# Altium schematic sheet Current Regulator.SchDoc
size Letter
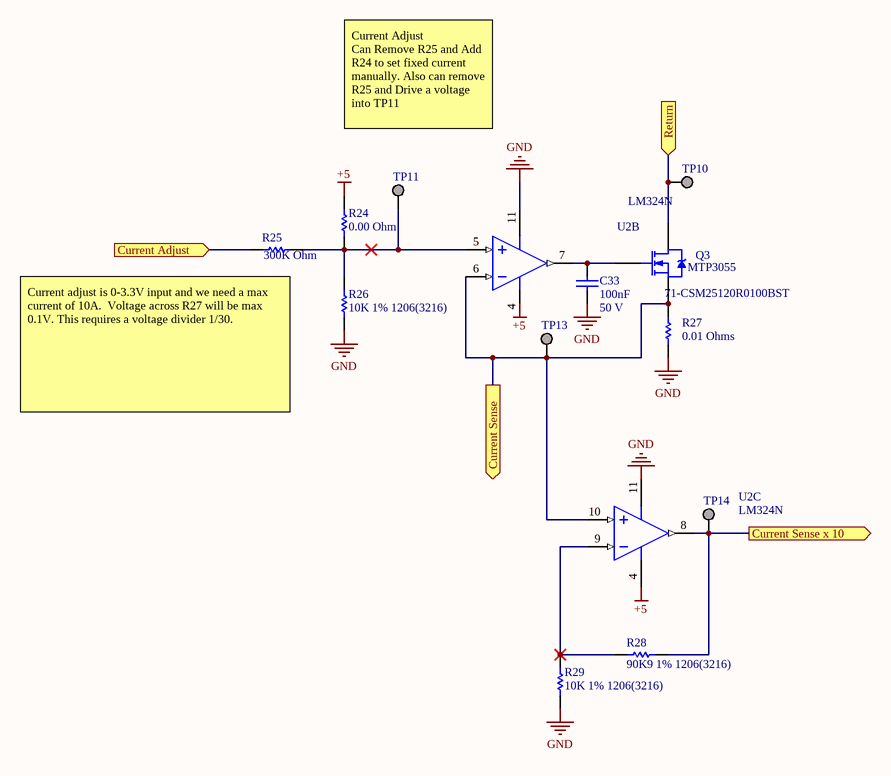
[diagram p0: Current Regulator.SchDoc]

## Parts
C33  value 100nF  Rated Voltage: 50 V  [CAPC1206(3216)100_N]  (hidden comment: CAP 100nF 50V 1206(3216))
Q3  MTP3055  [TO-220AB]
R24  value 0.00 Ohm  [RESC1206(3216)_L]  (hidden comment: Jumper 1206(3216))
R25  value 300K Ohm  [RESC1206(3216)_L]  (hidden comment: 300K 1% 1206(3216))
R26  10K 1% 1206(3216)  [RESC1206(3216)_L]
R27  value 0.01 Ohms  Supplier Part Number 1: 71-CSM25120R0100BST  [RESC2512(6432)_L]  (hidden comment: 0.01Ohms 1% 2512(6432))
R28  90K9 1% 1206(3216)  [RESC1206(3216)_L]
R29  10K 1% 1206(3216)  [RESC1206(3216)_L]
TP10  Return  [KSTN-1502-2]  (value not drawn)
TP11  Current Adjust  [KSTN-1502-2]  (value not drawn)
TP13  Current Sense  [KSTN-1502-2]  (value not drawn)
TP14  Current Sense 10x  [KSTN-1502-2]  (value not drawn)
U2  LM324N  [N14A]  (parts B,C of 4)

## Ports
Current Adjust (in), Current Sense (out), Current Sense x 10 (out), Return (in)

## Nets
+5: R24.2 U2.4(V+)
GND: C33.2 R26.1 R27.1 R29.1 U2.11(GND)
Current Adjust: R25.1 ; port Current Adjust
Current Sense: Q3.3(S) R27.2 TP13.1 U2.6(IN2-) U2.10(IN3+) ; port Current Sense
Current Sense x 10: R28.2 TP14.1 U2.8(OUT3) ; port Current Sense x 10
Return: Q3.2(D) TP10.1 ; port Return
NetC33_1: C33.1 Q3.1(G) U2.7(OUT2)
NetR24_1: R24.1 R25.2 R26.2 TP11.1 U2.5(IN2+)
NetR28_1: R28.1 R29.2 U2.9(IN3-)

## Notes on the sheet
- Current Adjust
  Can Remove R25 and Add R24 to set fixed current manually. Also can remove R25 and Drive a voltage into TP11
- (near R25) Current adjust is 0-3.3V input and we need a max current of 10A.  Voltage across R27 will be max 0.1V. This requires a voltage divider 1/30.
- Labels drawn without touching a wire or pin: +5

## Library data of the parts
C33 = CMP-1037-04202-1: CAP 100nF 50V ±10% 1206 (3216 Metric) Thickness 1mm SMD; Case-Metric: 3216; Tolerance: Â±10%; Case-EIA: 1206; Technology: SMT; Max Thickness: 1 mm
Q3 = NMOS-2: N-Channel Power MOSFET; Note: Pin 2 is electrically connected to pin 4.; Published: 8-Jun-2000; LatestRevisionDate: 17-Jul-2002; LatestRevisionNote: Re-released for DXP Platform.; DatasheetVersion: PD-9.814; PackageVersion: Feb-1997; PackageReference: TO-220AB; Publisher: Altium Limited; PackageDescription: TO, Thru-Hole, Vertical, Heatsink Mounted; 3 In-Line Leads; Pitch 2.54 mm; ComponentLink1Description: Manufacturer Link; ComponentLink1URL: http://www.irf.com/; Supplier 1: Mouser; Supplier Part Number 1: 512-MTP3055VL
R24 = CMP-1014-00001-1: Jumper 1206 (3216 Metric); Tolerance: None; Case-EIA: 1206; Case-Metric: 3216; Populate: 0; Technology: SMT; Power: None
R25 = CMP-1014-00788-1: 300K 0.25W 1% 1206 (3216 Metric)  SMD; Case-EIA: 1206; Case-Metric: 3216; Technology: SMT; Tolerance: 1 %; Power: 0.25 W
R26 = CMP-1014-00623-1: 10K 0.25W 1% 1206 (3216 Metric)  SMD; Case-Metric: 3216; Value: 10000.00 Ohm; Case-EIA: 1206; Populate: 0; Power: 0.25 W; Technology: SMT; Tolerance: 1 %
R27 = CMP-1018-00510-1: Case-EIA: 2512; Case-Metric: 6432; Power: 1 W; Technology: SMT; Tolerance: 1 %; Supplier 1: Mouser
R28 = CMP-1014-00731-1: 90K9 0.25W 1% 1206 (3216 Metric)  SMD; Case-Metric: 3216; Case-EIA: 1206; Value: 90900.00 Ohm; Tolerance: 1 %; Power: 0.25 W; Technology: SMT
R29 = CMP-1014-00623-1: 10K 0.25W 1% 1206 (3216 Metric)  SMD; Case-Metric: 3216; Value: 10000.00 Ohm; Case-EIA: 1206; Power: 0.25 W; Technology: SMT; Tolerance: 1 %
TP10 = CMP-1672-00001-4: Contact Finish: Tin; Lead Pitch: 0.218 inch; PackageReference: 1502-2; Mount: Through Hole; Pins: 50; DatasheetVersion: Rev. A, 02/2008; RoHSCompliant: true; REACH SVHC: No SVHC; Contact Material: Brass; Length: 2.77 mm; PackageDescription: 1-Pin Through Hole Device, Dia 3.18 mm; Package Quantity: 1; Mounting Technology: Through Hole; Supplier 1: Mouser; Supplier Part Number 1: 575-2501200800000
TP11 TP13 TP14 = CMP-1672-00001-4: Terminal DBL Turret, Through Hole, RoHS; Contact Finish: Tin; Lead Pitch: 0.218 inch; PackageReference: 1502-2; Mount: Through Hole; Pins: 50; DatasheetVersion: Rev. A, 02/2008; RoHSCompliant: true; REACH SVHC: No SVHC; Contact Material: Brass; Length: 2.77 mm; PackageDescription: 1-Pin Through Hole Device, Dia 3.18 mm; Package Quantity: 1; Mounting Technology: Through Hole; Supplier 1: Mouser; Supplier Part Number 1: 575-2501200800000
U2 = CMP-0055-00082-1: Low Power Quad Operational Amplifier, 14-pin MDIP; Manufacturer: National Semiconductor; PackageTopMarking: NSUZXYYTTE#*LM324N; PowerWise: N; CompType: Amplifiers; PinCount: 14; PackageVersion: revG, May-2006; PackageReference: N14A; Code_JEDEC: MS-001-AA; PackageDescription: MDIP, .750 x .250 x.130in, 14 Lead, .100in Pitch; RoHS: N; DatasheetVersion: Aug-2000